# Altium schematic sheet PX4FMUv2.3_SCH1.SchDoc
size A4
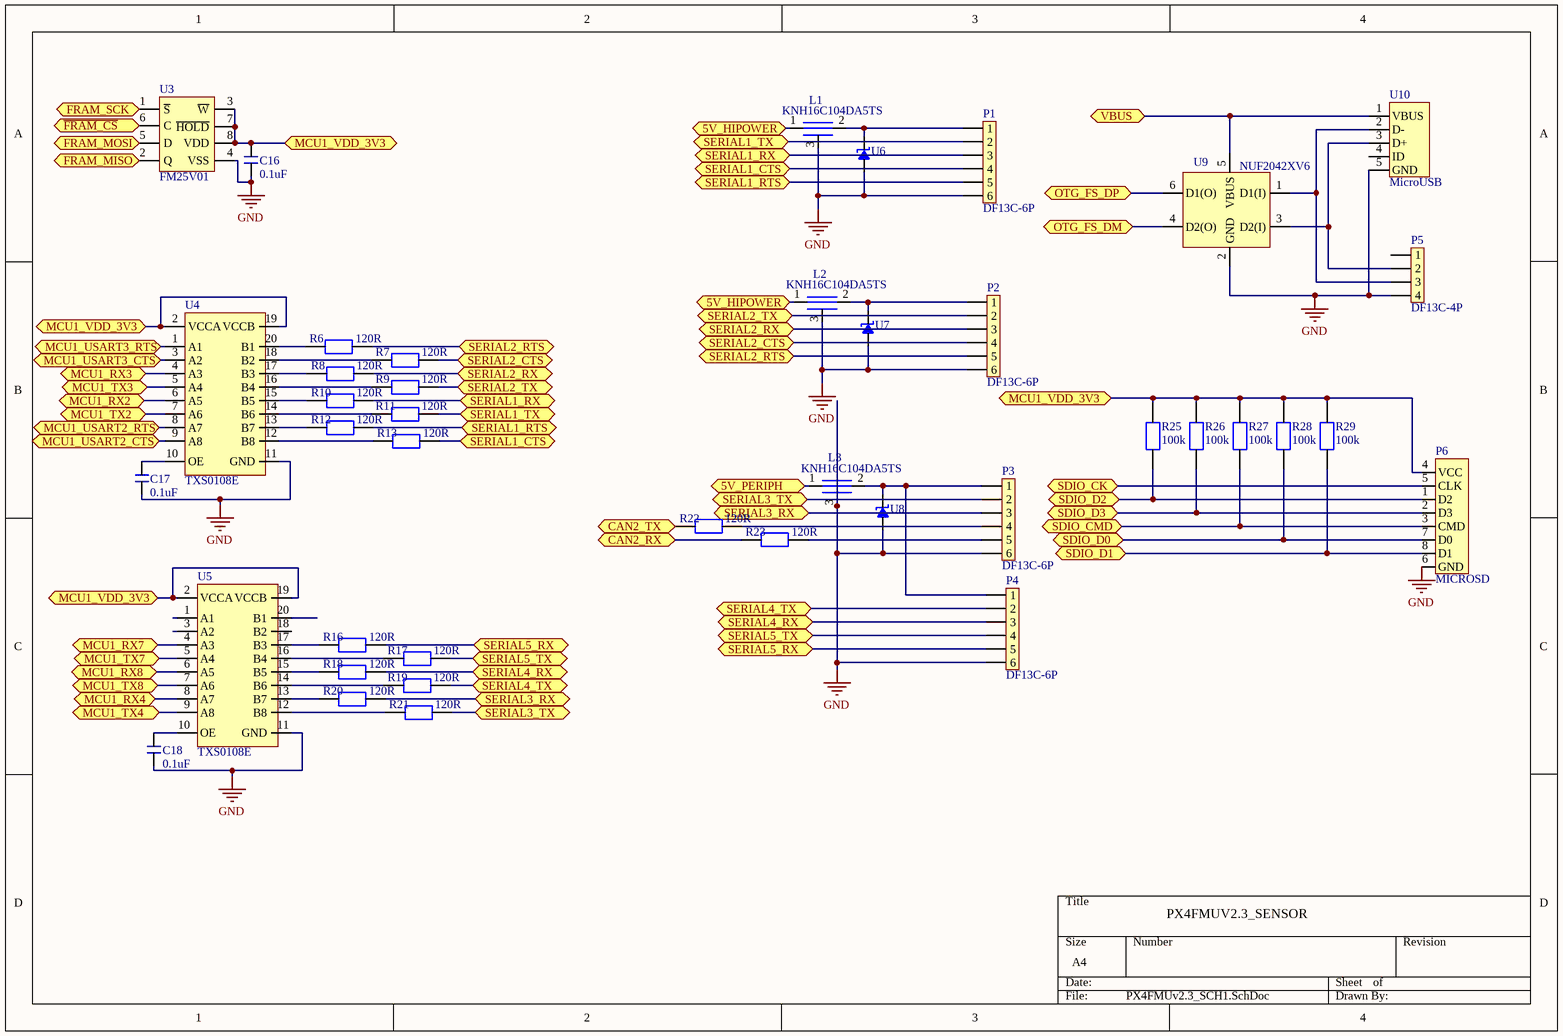
[diagram p0: PX4FMUv2.3_SCH1.SchDoc]

## Parts
C16  0.1uF  [C 0402]
C17  0.1uF  [C 0402]
C18  0.1uF  [C 0402]
L1  KNH16C104DA5TS  [KYOCERA-KNH16-DA]
L2  KNH16C104DA5TS  [KYOCERA-KNH16-DA]
L3  KNH16C104DA5TS  [KYOCERA-KNH16-DA]
P1  DF13C-6P  [MX 1.25-LS-6P]
P2  DF13C-6P  [MX 1.25-LS-6P]
P3  DF13C-6P  [MX 1.25-LS-6P]
P4  DF13C-6P  [MX 1.25-LS-6P]
P5  DF13C-4P  [MX 1.25-LS-4P]
P6  MICROSD  [microSD]
R6  120R  [0402R]
R7  120R  [0402R]
R8  120R  [0402R]
R9  120R  [0402R]
R10  120R  [0402R]
R11  120R  [0402R]
R12  120R  [0402R]
R13  120R  [0402R]
R16  120R  [0402R]
R17  120R  [0402R]
R18  120R  [0402R]
R19  120R  [0402R]
R20  120R  [0402R]
R21  120R  [0402R]
R22  120R  [0402R]
R23  120R  [0402R]
R25  100k  [0402R]
R26  100k  [0402R]
R27  100k  [0402R]
R28  100k  [0402R]
R29  100k  [0402R]
U3  FM25V01  [SOIC8]
U4  TXS0108E  [PQFN50P450X350X100_HS-21N]
U5  TXS0108E  [PQFN50P450X350X100_HS-21N]
U6  PESD0402-140  [0402-TVS]  (value not drawn)
U7  PESD0402-140  [0402-TVS]  (value not drawn)
U8  PESD0402-140  [0402-TVS]  (value not drawn)
U9  NUF2042XV6  [SOT563-6]
U10  MicroUSB  [USB-MICRO_E]

## Ports
5V_HIPOWER (bidir), 5V_PERIPH (bidir), CAN2_RX (bidir), CAN2_TX (bidir), FRAM_MISO (bidir), FRAM_MOSI (bidir), FRAM_SCK (bidir), MCU1_RX2 (bidir), MCU1_RX3 (bidir), MCU1_RX4 (bidir), MCU1_RX7 (bidir), MCU1_RX8 (bidir), MCU1_TX2 (bidir), MCU1_TX3 (bidir), MCU1_TX4 (bidir), MCU1_TX7 (bidir), MCU1_TX8 (bidir), MCU1_USART2_CTS (bidir), MCU1_USART2_RTS (bidir), MCU1_USART3_CTS (bidir), MCU1_USART3_RTS (bidir), MCU1_VDD_3V3 (bidir), OTG_FS_DM (bidir), OTG_FS_DP (bidir), SDIO_CK (bidir), SDIO_CMD (bidir), SDIO_D0 (bidir), SDIO_D1 (bidir), SDIO_D2 (bidir), SDIO_D3 (bidir), SERIAL1_CTS (bidir), SERIAL1_RTS (bidir), SERIAL1_RX (bidir), SERIAL1_TX (bidir), SERIAL2_CTS (bidir), SERIAL2_RTS (bidir), SERIAL2_RX (bidir), SERIAL2_TX (bidir), SERIAL3_RX (bidir), SERIAL3_TX (bidir), SERIAL4_RX (bidir), SERIAL4_TX (bidir), SERIAL5_RX (bidir), SERIAL5_TX (bidir), VBUS (bidir), ~{FRAM_CS} (bidir)

## Nets
GND: C16.2 C17.2 C18.2 L1.3 L2.3 L3.3 P1.6 P2.6 P3.6 P4.6 P5.4 P6.6(GND) U3.4(VSS) U4.11(GND) U5.11(GND) U6.1 U7.1 U8.1 U9.2(GND) U10.5(GND)
5V_HIPOWER: L1.1 L2.1 ; port 5V_HIPOWER
5V_PERIPH: L3.1 ; port 5V_PERIPH
CAN2_RX: R23.1 ; port CAN2_RX
CAN2_TX: R22.1 ; port CAN2_TX
~{FRAM_CS}: U3.6(C) ; port ~{FRAM_CS}
FRAM_MISO: U3.2(Q) ; port FRAM_MISO
FRAM_MOSI: U3.5(D) ; port FRAM_MOSI
FRAM_SCK: U3.1(~{S}) ; port FRAM_SCK
MCU1_RX2: U4.6(A5) ; port MCU1_RX2
MCU1_RX3: U4.4(A3) ; port MCU1_RX3
MCU1_RX4: U5.8(A7) ; port MCU1_RX4
MCU1_RX7: U5.4(A3) ; port MCU1_RX7
MCU1_RX8: U5.6(A5) ; port MCU1_RX8
MCU1_TX2: U4.7(A6) ; port MCU1_TX2
MCU1_TX3: U4.5(A4) ; port MCU1_TX3
MCU1_TX4: U5.9(A8) ; port MCU1_TX4
MCU1_TX7: U5.5(A4) ; port MCU1_TX7
MCU1_TX8: U5.7(A6) ; port MCU1_TX8
MCU1_USART2_CTS: U4.9(A8) ; port MCU1_USART2_CTS
MCU1_USART2_RTS: U4.8(A7) ; port MCU1_USART2_RTS
MCU1_USART3_CTS: U4.3(A2) ; port MCU1_USART3_CTS
MCU1_USART3_RTS: U4.1(A1) ; port MCU1_USART3_RTS
MCU1_VDD_3V3: C16.1 P6.4(VCC) R25.2 R26.2 R27.2 R28.2 R29.2 U3.3(~{W}) U3.7(~{HOLD}) U3.8(VDD) U4.2(VCCA) U4.19(VCCB) U5.2(VCCA) U5.19(VCCB) ; port MCU1_VDD_3V3
OTG_FS_DM: U9.4(D2(O)) ; port OTG_FS_DM
OTG_FS_DP: U9.6(D1(O)) ; port OTG_FS_DP
SDIO_CK: P6.5(CLK) ; port SDIO_CK
SDIO_CMD: P6.3(CMD) R27.1 ; port SDIO_CMD
SDIO_D0: P6.7(D0) R28.1 ; port SDIO_D0
SDIO_D1: P6.8(D1) R29.1 ; port SDIO_D1
SDIO_D2: P6.1(D2) R25.1 ; port SDIO_D2
SDIO_D3: P6.2(D3) R26.1 ; port SDIO_D3
SERIAL1_CTS: P1.4 R13.2 ; port SERIAL1_CTS
SERIAL1_RTS: P1.5 R12.2 ; port SERIAL1_RTS
SERIAL1_RX: P1.3 R10.2 ; port SERIAL1_RX
SERIAL1_TX: P1.2 R11.2 ; port SERIAL1_TX
SERIAL2_CTS: P2.4 R7.2 ; port SERIAL2_CTS
SERIAL2_RTS: P2.5 R6.2 ; port SERIAL2_RTS
SERIAL2_RX: P2.3 R8.2 ; port SERIAL2_RX
SERIAL2_TX: P2.2 R9.2 ; port SERIAL2_TX
SERIAL3_RX: P3.3 R20.2 ; port SERIAL3_RX
SERIAL3_TX: P3.2 R21.2 ; port SERIAL3_TX
SERIAL4_RX: P4.3 R18.2 ; port SERIAL4_RX
SERIAL4_TX: P4.2 R19.2 ; port SERIAL4_TX
SERIAL5_RX: P4.5 R16.2 ; port SERIAL5_RX
SERIAL5_TX: P4.4 R17.2 ; port SERIAL5_TX
VBUS: U9.5(VBUS) U10.1(VBUS) ; port VBUS
NetC17_1: C17.1 U4.10(OE)
NetC18_1: C18.1 U5.10(OE)
NetL1_2: L1.2 P1.1 U6.2
NetL2_2: L2.2 P2.1 U7.2
NetL3_2: L3.2 P3.1 P4.1 U8.2
NetP3_4: P3.4 R22.2
NetP3_5: P3.5 R23.2
NetP5_2: P5.2 U9.3(D2(I)) U10.3(D+)
NetP5_3: P5.3 U9.1(D1(I)) U10.2(D-)
NetR6_1: R6.1 U4.20(B1)
NetR7_1: R7.1 U4.18(B2)
NetR8_1: R8.1 U4.17(B3)
NetR9_1: R9.1 U4.16(B4)
NetR10_1: R10.1 U4.15(B5)
NetR11_1: R11.1 U4.14(B6)
NetR12_1: R12.1 U4.13(B7)
NetR13_1: R13.1 U4.12(B8)
NetR16_1: R16.1 U5.17(B3)
NetR17_1: R17.1 U5.16(B4)
NetR18_1: R18.1 U5.15(B5)
NetR19_1: R19.1 U5.14(B6)
NetR20_1: R20.1 U5.13(B7)
NetR21_1: R21.1 U5.12(B8)

Not connected (* = marked no-connect by the designer): P5 1; U5 1(A1) 3(A2) 18(B2) 20(B1); U10 4(ID)

## Notes on the sheet
- PX4FMUV2.3_SENSOR

## Library data of the parts
C16-C18 = CAP_0402
R6-R13 R16-R23 R25-R29 = Res_0402
U10 = MicroUSB_SMD